# Altium project ProyectoMulticapa.PrjPcb (part 3 of 3)

## Sheet [5] In Circuit Debug Interface.SchDoc
size Letter; Author: Ángel O., Victor V.; DocumentNumber: 5; Revision: 1.0; SheetNumber: 5; SheetTotal: 6
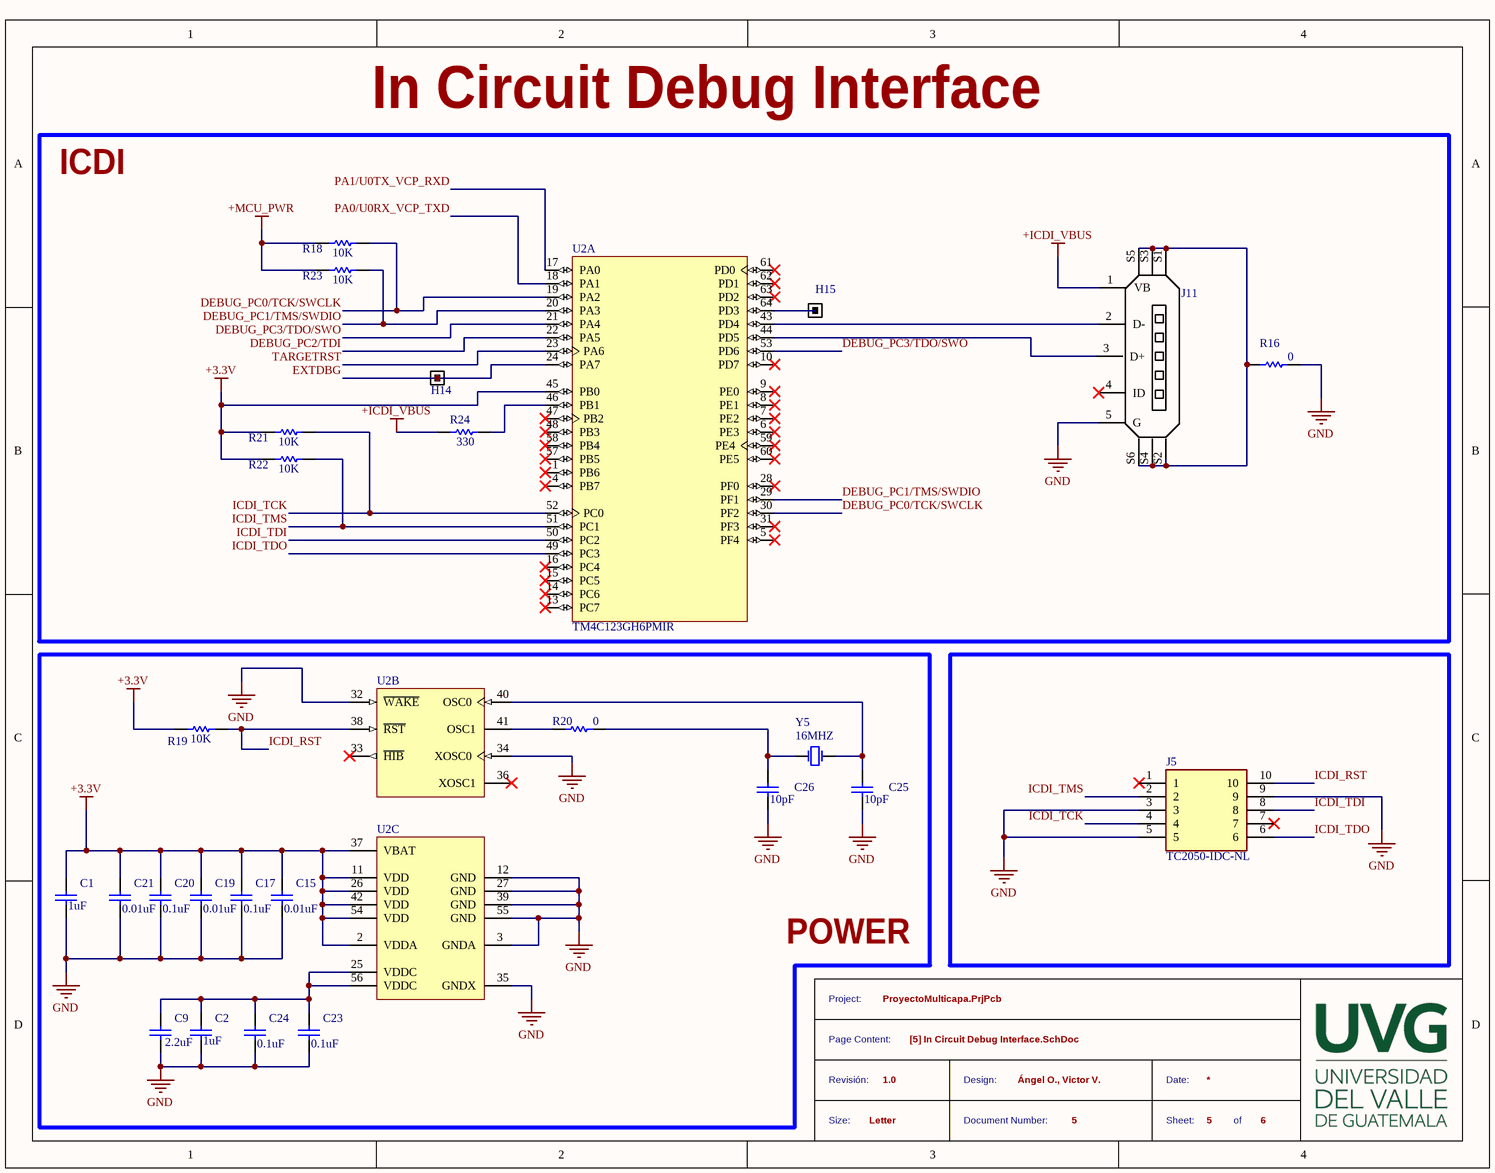
[diagram p5: [5] In Circuit Debug Interface.SchDoc]

### Parts
C1  capacitor Johanson Dielectrics Inc  [C0402 imperial]  (value not drawn)
C2  capacitor Johanson Dielectrics Inc  [C0402 imperial]  (value not drawn)
C9  GRM188R61C225KE15D  [CAPC1608X90X35LL10T15]  (value not drawn)
C15  EMK105B7103KV-F  [CAPC1005]  (value not drawn)
C17  EMK105B7104KV-F  [CAPC1005]  (value not drawn)
C19  EMK105B7103KV-F  [CAPC1005]  (value not drawn)
C20  EMK105B7104KV-F  [CAPC1005]  (value not drawn)
C21  EMK105B7103KV-F  [CAPC1005]  (value not drawn)
C23  EMK105B7104KV-F  [CAPC1005]  (value not drawn)
C24  EMK105B7104KV-F  [CAPC1005]  (value not drawn)
C25  GRM1555C1H100JZ01D  [CAPC1005X55X25LL05T10]  (value not drawn)
C26  GRM1555C1H100JZ01D  [CAPC1005X55X25LL05T10]  (value not drawn)
H14  header  [HEADER 1]  (value not drawn)
H15  header  [HEADER 1]  (value not drawn)
J5  TC2050-IDC-NL  [TAG-CONNECT_TC2050-IDC-NL]
J11  ZX62-B-5PA  [ZX62B5PA]  (value not drawn)
R16  ERJ-3GEY0R00V  [FP-ERJ-3GEY0R00V-IPC_A]  (value not drawn)
R18  RC0402FR-0710KL  [RESC1005X40X25LL05T10]  (value not drawn)
R19  RC0402FR-0710KL  [RESC1005X40X25LL05T10]  (value not drawn)
R20  ERJ-3GEY0R00V  [FP-ERJ-3GEY0R00V-IPC_A]  (value not drawn)
R21  RC0402FR-0710KL  [RESC1005X40X25LL05T10]  (value not drawn)
R22  RC0402FR-0710KL  [RESC1005X40X25LL05T10]  (value not drawn)
R23  RC0402FR-0710KL  [RESC1005X40X25LL05T10]  (value not drawn)
R24  RC0402FR-07330RL  [RESC1005X40X25LL05T10]  (value not drawn)
U2  TM4C123GH6PMIR  [PM0064A_L]  (parts A,B,C of 3)
Y5  NX5032GA-16.000000MHZ  [NX5032GA16000000MHZLNCD1]  (value not drawn)

### Blocks framed on the sheet
ICDI: H14 H15 J11 R16 R18 R21-R24 U2
POWER: C1 C2 C9 C15 C17 C19-C21 C23-C26 R19 R20 U2 Y5

### Nets
+3.3V: C1.1 C15.1 C17.1 C19.1 C20.1 C21.1 R19.1 R21.1 R22.1 U2.2(VDDA) U2.11(VDD) U2.26(VDD) U2.37(VBAT) U2.42(VDD) U2.45(PB0) U2.54(VDD)
+ICDI_VBUS: J11.1(VB) R24.1
+MCU_PWR: R18.1 R23.1
GND: C1.2 C2.2 C9.2 C15.2 C17.2 C19.2 C20.2 C21.2 C23.2 C24.2 C25.2 C26.2 J5.3 J5.5 J5.9 J11.5(G) R16.2 U2.3(GNDA) U2.12(GND) U2.27(GND) U2.32(~{WAKE}) U2.34(XOSC0) U2.35(GNDX) U2.39(GND) U2.55(GND)
DEBUG_PC0/TCK/SWCLK: R18.2 U2.19(PA2) U2.30(PF2)
DEBUG_PC1/TMS/SWDIO: R23.2 U2.20(PA3) U2.29(PF1)
DEBUG_PC2/TDI: U2.22(PA5)
DEBUG_PC3/TDO/SWO: U2.21(PA4) U2.53(PD6)
EXTDBG: H14.1 U2.24(PA7)
ICDI_RST: J5.10 R19.2 U2.38(~{RST})
ICDI_TCK: J5.4 R21.2 U2.52(PC0)
ICDI_TDI: J5.8 U2.50(PC2)
ICDI_TDO: J5.6 U2.49(PC3)
ICDI_TMS: J5.2 R22.2 U2.51(PC1)
PA0/U0RX_VCP_TXD: U2.18(PA1)
PA1/U0TX_VCP_RXD: U2.17(PA0)
TARGETRST: U2.23(PA6)
NetC2_1: C2.1 C9.1 C23.1 C24.1 U2.25(VDDC) U2.56(VDDC)
NetC25_1: C25.1 U2.40(OSC0) Y5.2
NetC26_1: C26.1 R20.2 Y5.1
NetH15_1: H15.1 U2.64(PD3)
NetJ11_2: J11.2(D-) U2.43(PD4)
NetJ11_3: J11.3(D+) U2.44(PD5)
NetJ11_S1: J11.S1 J11.S2 J11.S3 J11.S4 J11.S5 J11.S6 R16.1
NetR20_1: R20.1 U2.41(OSC1)
NetR24_2: R24.2 U2.46(PB1)

Not connected (* = marked no-connect by the designer): J5 1* 7*; J11 4(ID)*; U2 1(PB6)* 4(PB7)* 5(PF4)* 6(PE3)* 7(PE2)* 8(PE1)* 9(PE0)* 10(PD7)* 13(PC7)* 14(PC6)* 15(PC5)* 16(PC4)* 28(PF0)* 31(PF3)* 33(~{HIB})* 36(XOSC1)* 47(PB2)* 48(PB3)* 57(PB5)* 58(PB4)* 59(PE4)* 60(PE5)* 61(PD0)* 62(PD1)* 63(PD2)*

### Notes on the sheet
- In Circuit Debug Interface
- Project:
- Page Content:
- Revisión:
- Size:
- Letter
- Design:
- Document Number:
- Date:
- Sheet:
- of
- (in symbol EMK105B7103KV-F) 0.01uF
- (in symbol EMK105B7104KV-F) 0.1uF
- (in symbol ERJ-3GEY0R00V) 0
- (in symbol NX5032GA-16.000000MHZ) 16MHZ
- (in symbol RC0402FR-0710KL) 10K
- (in symbol RC0402FR-07330RL) 330

### Library data of the parts
C1 C2 = 100R07X105KV4T: Cap Ceramic 1uF 10V X5R 10% SMD 0402 85C T/R; Supplier 1: Mouser; Manufacturer: Johanson; Manufacturer Part Number: 100R07X105KV4T; Stock 1: 173156; Pricing 1: 1 = 0.26000, 10 = 0.13400, 50 = 0.13400, 100 = 0.07600, 1000 = 0.04900, 10000 = 0.04000 (USD); RoHS: Yes; Mount: Surface Mount; Case/Package: 0402; Number of Pins: 2; Case Code (Metric): 1005; Case Code (Imperial): 0402; Weight: 2.3E-05oz; Min Operating Temperature: -55°C; Max Operating Temperature: 85°C; Capacitance: 1uF; Tolerance: 10%; Voltage Rating: 10V; Packaging: Tape and Reel; Package Quantity: 10000; Voltage Rating (DC): 10V; Dielectric: X5R; Termination: SMD/SMT; Series: TANCERAM®; Length: 1.02mm; Width: 0.02inch; Height: 0.64mm; Thickness: 0.025inch; Depth: 0.51mm; Radiation Hardening: No; REACH SVHC: No SVHC; RoHS Compliant: Yes; ComponentLink1URL: https://datasheet.ciiva.com/26948/getdatasheetpartid-789067-26948543.pdf?src-supplier=Verical; ComponentLink1Description: https://datasheet.ciiva.com/26948/getdatasheetpartid-789067-26948543.pdf?src-supplier=Verical; ComponentLink2URL: https://datasheet.ciiva.com/22693/jdi-full-catalog-2012-01-22693744.pdf?src-supplier=Element14; ComponentLink2Description: https://datasheet.ciiva.com/22693/jdi-full-catalog-2012-01-22693744.pdf?src-supplier=Element14; Supplier Part Number 1: 605-100R07X105KV4T
C9 = GRM188R61C225KE15D: Cap Ceramic 2.2uF 16V X5R 10% SMD 0603 85C Paper T/R; Manufacturer: Murata; Supplier 1: Farnell; Manufacturer Part Number: GRM188R61C225KE15D; Stock 1: 0; Pricing 1: 10 = 0.13600, 100 = 0.08010, 500 = 0.05040, 1000 = 0.04260, 2000 = 0.03240 (GBP); RoHS: Yes; Mount: Surface Mount; Case/Package: 0603; Case Code (Imperial): 0603; Case Code (Metric): 1608; Material: Ceramic; Min Operating Temperature: -55°C; Max Operating Temperature: 85°C; Capacitance: 2.2uF; Tolerance: 10%; Dielectric: X5R; Voltage Rating: 16V; Voltage Rating (DC): 16V; Packaging: Tape and Reel; Package Quantity: 1; Termination: SMD/SMT; Voltage: 16V; Length: 1.6mm; Width: 0.8mm; Height: 0.8mm; Thickness: 0.035inch; Depth: 0.8mm; Radiation Hardening: No; RoHS Compliant: Yes; Lead Free: Lead Free; REACH SVHC: No SVHC; ComponentLink1URL: https://datasheet.ciiva.com/135/grm188r61c225ke15-01-135062.pdf?src-supplier=Digi-Key; ComponentLink1Description: https://datasheet.ciiva.com/135/grm188r61c225ke15-01-135062.pdf?src-supplier=Digi-Key; ComponentLink2URL: https://datasheet.ciiva.com/135/grm188r61c225ke15-01-135063.pdf?src-supplier=Digi-Key; ComponentLink2Description: https://datasheet.ciiva.com/135/grm188r61c225ke15-01-135063.pdf?src-supplier=Digi-Key; ComponentLink3URL: https://datasheet.ciiva.com/5417/product-5417088.pdf?src-supplier=Mouser; ComponentLink3Description: https://datasheet.ciiva.com/5417/product-5417088.pdf?src-supplier=Mouser; ComponentLink4URL: https://datasheet.ciiva.com/3777/147grm188r61c225ke1523-3777042.pdf?src-supplier=Arrow+Electronics; ComponentLink4Description: https://datasheet.ciiva.com/3777/147grm188r61c225ke1523-3777042.pdf?src-supplier=Arrow+Electronics; ComponentLink5URL: https://datasheet.ciiva.com/29199/454457-da-01-en-vs-kondensator-0603-29199689.pdf?src-supplier=Conrad; ComponentLink5Description: https://datasheet.ciiva.com/29199/454457-da-01-en-vs-kondensator-0603-29199689.pdf?src-supplier=Conrad; ComponentLink6URL: https://datasheet.ciiva.com/135/grm188r61c225ke15-01-135061.pdf?src-supplier=Digi-Key; ComponentLink6Description: https://datasheet.ciiva.com/135/grm188r61c225ke15-01-135061.pdf?src-supplier=Digi-Key; ComponentLink7URL: https://datasheet.ciiva.com/16369/product-16369274.pdf?src-supplier=Future+Electronics; ComponentLink7Description: https://datasheet.ciiva.com/16369/product-16369274.pdf?src-supplier=Future+Electronics; Supplier Part Number 1: 1735526
C15 C19 C21 = EMK105B7103KV-F: TAIYO YUDEN   EMK105B7103KV-F   CERAMIC CAPACITOR, 0.01UF, 16V, X7R, 10%, 0402, FULL REEL; Capacitance: 10nF; Supplier 1: Digi-Key; Manufacturer: Taiyo Yuden; Manufacturer Part Number: EMK105B7103KV-F; Stock 1: 171674; Pricing 1: 1 = 0.10000, 10 = 0.02500, 50 = 0.01380, 100 = 0.01130, 500 = 0.00804, 1000 = 0.00632, 2500 = 0.00575, 5000 = 0.00529 (USD); RoHS: Yes; Mount: Surface Mount; Case/Package: 0402; Number of Pins: 2; Case Code (Metric): 1005; Case Code (Imperial): 0402; Contact Plating: Tin; Min Operating Temperature: -55°C; Max Operating Temperature: 125°C; Package Quantity: 1; Voltage Rating: 16V; Tolerance: 10%; Packaging: Tape and Reel; Voltage Rating (DC): 16V; Dielectric: X7R; Termination: SMD/SMT; Series: M; Construction: Flat; Resistor Type: Ceramic; Length: 1mm; Width: 0.02inch; Height: 0.5mm; Thickness: 0.022inch; Depth: 0.5mm; Radiation Hardening: No; REACH SVHC: Unknown; RoHS Compliant: Yes; ComponentLink1URL: https://datasheet.ciiva.com/156/mlcc-all-e-156078.pdf?src-supplier=Digi-Key; ComponentLink1Description: https://datasheet.ciiva.com/156/mlcc-all-e-156078.pdf?src-supplier=Digi-Key; ComponentLink2URL: https://datasheet.ciiva.com/156/mlcc-all-e-156079.pdf?src-supplier=Digi-Key; ComponentLink2Description: https://datasheet.ciiva.com/156/mlcc-all-e-156079.pdf?src-supplier=Digi-Key; ComponentLink3URL: https://datasheet.ciiva.com/156/mlcc-all-e-156080.pdf?src-supplier=Digi-Key; ComponentLink3Description: https://datasheet.ciiva.com/156/mlcc-all-e-156080.pdf?src-supplier=Digi-Key; ComponentLink4URL: https://datasheet.ciiva.com/11596/mlcc01-e-11596553.pdf?src-supplier=Avnet; ComponentLink4Description: https://datasheet.ciiva.com/11596/mlcc01-e-11596553.pdf?src-supplier=Avnet; ComponentLink5URL: https://datasheet.ciiva.com/28644/746258-28644943.pdf?src-supplier=Element14; ComponentLink5Description: https://datasheet.ciiva.com/28644/746258-28644943.pdf?src-supplier=Element14; ComponentLink6URL: https://datasheet.ciiva.com/7975/1481447-7975594.pdf?src-supplier=Element14; ComponentLink6Description: https://datasheet.ciiva.com/7975/1481447-7975594.pdf?src-supplier=Element14; Supplier Part Number 1: 587-2708-1-ND
C17 C20 C23 C24 = EMK105B7104KV-F: TAIYO YUDEN - EMK105B7104KV-F - SMD Multilayer Ceramic Capacitor, 0.1 &#181;F, 16 V, 0402 [1005 Metric], &#177; 10%, X7R, M Series; Capacitance: 100nF; Voltage Rating (DC): 16V; Supplier 1: Digi-Key; Manufacturer: Taiyo Yuden; Manufacturer Part Number: EMK105B7104KV-F; Stock 1: 5046270; Pricing 1: 1 = 0.10000, 10 = 0.02400, 50 = 0.01320, 100 = 0.01070, 500 = 0.00764, 1000 = 0.00601, 2500 = 0.00546, 5000 = 0.00503 (USD); RoHS: Yes; Mount: Surface Mount; Case/Package: 0402; Number of Pins: 2; Case Code (Metric): 1005; Case Code (Imperial): 0402; Min Operating Temperature: -55°C; Max Operating Temperature: 125°C; Tolerance: 10%; Packaging: Tape and Reel; Dielectric: X7R; Package Quantity: 1; Voltage Rating: 16V; Termination: SMD/SMT; Series: M; Construction: Flat; Resistor Type: Ceramic; Length: 1mm; Width: 0.02inch; Height: 0.5mm; Thickness: 0.022inch; Depth: 0.5mm; Radiation Hardening: No; Halogen Free: Halogen Free; REACH SVHC: Unknown; RoHS Compliant: Yes; Lead Free: Lead Free; ComponentLink1URL: https://datasheet.ciiva.com/129/emk105b7104kv-f-ss-129714.pdf?src-supplier=Digi-Key; ComponentLink1Description: https://datasheet.ciiva.com/129/emk105b7104kv-f-ss-129714.pdf?src-supplier=Digi-Key; ComponentLink2URL: https://datasheet.ciiva.com/30227/emk105b7104kv-f-30227394.pdf?src-supplier=Onlinecomponents.com; ComponentLink2Description: https://datasheet.ciiva.com/30227/emk105b7104kv-f-30227394.pdf?src-supplier=Onlinecomponents.com; ComponentLink3URL: https://datasheet.ciiva.com/22748/746258-22748959.pdf?src-supplier=Element14; ComponentLink3Description: https://datasheet.ciiva.com/22748/746258-22748959.pdf?src-supplier=Element14; Supplier Part Number 1: 587-1451-1-ND
C25 C26 = GRM1555C1H100JZ01D: CAP, CERAMIC, 10PF, 50V, C0G/NP0, 0402; Manufacturer: Murata; Tolerance: 5%; Dielectric: C0G; Insulation Resistance: 10GR; Temperature Coefficient: 30ppm/°C; Supplier 1: Farnell; Manufacturer Part Number: GRM1555C1H100JZ01D; Stock 1: 0; Pricing 1: 1 = 37.68000, 3 = 28.53000 (GBP); RoHS: Yes; Mount: Surface Mount; Case/Package: 0402; Number of Pins: 2; Case Code (Imperial): 0402; Case Code (Metric): 1005; Dielectric Material: Ceramic; Min Operating Temperature: -55°C; Max Operating Temperature: 125°C; Capacitance: 10pF; Voltage Rating: 50V; Voltage Rating (DC): 50V; Packaging: Tape and Reel; Package Quantity: 1; Termination: SMD/SMT; Voltage: 50V; Series: GRM; Construction: Flat; Length: 1mm; Width: 0.5mm; Height: 0.5mm; Thickness: 0.022inch; Depth: 0.5mm; Size: 0.5mm; Radiation Hardening: No; REACH SVHC: No SVHC; Lead Free: Lead Free; RoHS Compliant: Yes; ComponentLink1URL: https://datasheet.ciiva.com/129/partnumbering-e-01-129819.pdf?src-supplier=Digi-Key; ComponentLink1Description: https://datasheet.ciiva.com/129/partnumbering-e-01-129819.pdf?src-supplier=Digi-Key; ComponentLink2URL: https://datasheet.ciiva.com/129/partnumbering-e-01-129820.pdf?src-supplier=Digi-Key; ComponentLink2Description: https://datasheet.ciiva.com/129/partnumbering-e-01-129820.pdf?src-supplier=Digi-Key; ComponentLink3URL: https://datasheet.ciiva.com/129/partnumbering-e-01-129821.pdf?src-supplier=Digi-Key; ComponentLink3Description: https://datasheet.ciiva.com/129/partnumbering-e-01-129821.pdf?src-supplier=Digi-Key; ComponentLink4URL: https://datasheet.ciiva.com/19476/1855887-19476237.pdf?src-supplier=Jameco; ComponentLink4Description: https://datasheet.ciiva.com/19476/1855887-19476237.pdf?src-supplier=Jameco; ComponentLink5URL: https://datasheet.ciiva.com/18184/getdatasheetpartid-91958-18184166.pdf?src-supplier=Verical; ComponentLink5Description: https://datasheet.ciiva.com/18184/getdatasheetpartid-91958-18184166.pdf?src-supplier=Verical; ComponentLink6URL: https://datasheet.ciiva.com/11787/0900766b807a1cab-11787097.pdf?src-supplier=RSComponents; ComponentLink6Description: https://datasheet.ciiva.com/11787/0900766b807a1cab-11787097.pdf?src-supplier=RSComponents; ComponentLink7URL: https://datasheet.ciiva.com/6068/1747431-6068159.pdf?src-supplier=Farnell; ComponentLink7Description: https://datasheet.ciiva.com/6068/1747431-6068159.pdf?src-supplier=Farnell; ComponentLink8URL: https://datasheet.ciiva.com/11607/c02e-11607480.pdf?src-supplier=Avnet; ComponentLink8Description: https://datasheet.ciiva.com/11607/c02e-11607480.pdf?src-supplier=Avnet; ComponentLink9URL: https://datasheet.ciiva.com/14116/grmseries-tc-hitype-eng-14116856.pdf?src-supplier=Distrelec; ComponentLink9Description: https://datasheet.ciiva.com/14116/grmseries-tc-hitype-eng-14116856.pdf?src-supplier=Distrelec; ComponentLink10URL: https://datasheet.ciiva.com/14116/grmseries-tc-hitype-eng-14116917.pdf?src-supplier=Distrelec; ComponentLink10Description: https://datasheet.ciiva.com/14116/grmseries-tc-hitype-eng-14116917.pdf?src-supplier=Distrelec; ComponentLink11URL: https://datasheet.ciiva.com/7828/1747431-7828813.pdf?src-supplier=Element14; ComponentLink11Description: https://datasheet.ciiva.com/7828/1747431-7828813.pdf?src-supplier=Element14; ComponentLink12URL: https://datasheet.ciiva.com/7828/1747431-7828815.pdf?src-supplier=Element14; ComponentLink12Description: https://datasheet.ciiva.com/7828/1747431-7828815.pdf?src-supplier=Element14; Supplier Part Number 1: 1118131
H14 H15 = header: Pads header que aparecen en la tiva
J5 = TC2050-IDC-NL: Plug-Of-Nailsâ„¢ Adapter Cable; MF: Tag-Connect LLC; MP: TC2050-IDC-NL; Availability: Unavailable; Package: None; Value: *; Price: None; SnapEDA_Link: https://www.snapeda.com/parts/TC2050-IDC-NL/Tag-Connect%20LLC/view-part/134534/?ref=snap
J11 = ZX62-B-5PA: USB Connectors MICRO B RECEPT RA SMT BTTM MNT; Manufacturer: Hirose; Manufacturer Part Number: ZX62-B-5PA(11); Number of Terminals/Pins: 5; Connector Type: USB,Receptacle; Gender: Receptacle; Current Rating: 1A; Mating Cycles: 10000; Voltage Rating: 30V; Number of Ports: 1; USB Standard: USB 2.0; Pitch: 0.65mm; Supplier 1: Farnell; Stock 1: 0; Pricing 1: 10 = 0.60800, 50 = 0.48000, 100 = 0.44900, 250 = 0.43000, 500 = 0.39100, 1000 = 0.35900 (GBP); RoHS: Yes; Mount: Surface Mount,Horizontal; Contact Plating: Gold; Contact Material: Copper Alloy; Min Operating Temperature: -30°C; Max Operating Temperature: 85°C; Packaging: Tape and Reel; Number of Contacts: 5; Package Quantity: 3500; Series: ZX62; Termination: Solder; Orientation: Right Angle; Number of Positions: 5; Max Voltage Rating (AC): 30V; Voltage Rating (AC): 30V; Length: 7.9mm; Depth: 5.6mm; Radiation Hardening: No; RoHS Compliant: Yes; REACH SVHC: No SVHC; Lead Free: Lead Free; Flammability Rating: UL94 V-0; ComponentLink1URL: https://datasheet.ciiva.com/11731/0900766b80d9c4df-11731324.pdf?src-supplier=RSComponents; ComponentLink1Description: https://datasheet.ciiva.com/11731/0900766b80d9c4df-11731324.pdf?src-supplier=RSComponents; ComponentLink2URL: https://datasheet.ciiva.com/15181/getdatasheetpartid-449685-15181366.pdf?src-supplier=Verical; ComponentLink2Description: https://datasheet.ciiva.com/15181/getdatasheetpartid-449685-15181366.pdf?src-supplier=Verical; ComponentLink3URL: https://datasheet.ciiva.com/7646/81390-7646778.pdf?src-supplier=Element14; ComponentLink3Description: https://datasheet.ciiva.com/7646/81390-7646778.pdf?src-supplier=Element14; Supplier 2: Mouser; Stock 2: 45031; Pricing 2: 1 = 0.61000, 10 = 0.57200, 50 = 0.57200, 100 = 0.46800, 1000 = 0.37700, 10000 = 0.33800 (USD); ComponentLink4URL: http://www.farnell.com/datasheets/2691174.pdf?src-supplier=Farnell; ComponentLink4Description: http://www.farnell.com/datasheets/2691174.pdf?src-supplier=Farnell; ComponentLink5URL: https://www.hirose.com/product/en/download_file/key_name/ZX62-B-5PA%2833%29/category/Specification%20Sheet/doc_file_id/87473/?file_category_id=9&item_id=02420033833&is_series=&src-supplier=Digi-Key; ComponentLink5Description: https://www.hirose.com/product/en/download_file/key_name/ZX62-B-5PA%2833%29/category/Specification%20Sheet/doc_file_id/87473/?file_category_id=9&item_id=02420033833&is_series=&src-supplier=Digi-Key; ComponentLink6URL: http://www.farnell.com/datasheets/2691174.pdf?src-supplier=Newark; ComponentLink6Description: http://www.farnell.com/datasheets/2691174.pdf?src-supplier=Newark; ComponentLink7URL: http://www.farnell.com/datasheets/2691174.pdf?src-supplier=Element14; ComponentLink7Description: http://www.farnell.com/datasheets/2691174.pdf?src-supplier=Element14; ComponentLink8URL: http://www.farnell.com/datasheets/2060515.pdf?src-supplier=Element14; ComponentLink8Description: http://www.farnell.com/datasheets/2060515.pdf?src-supplier=Element14; Supplier Part Number 1: 1645325; Supplier Part Number 2: 798-ZX62-B-5PA33
R16 R20 = ERJ-3GEY0R00V: Res Thick Film 0603 0 Ohm Jumper Molded SMD Punched Carrier T/R; Manufacturer: Panasonic; Resistance: 0R; Power Rating: 100mW; Voltage Rating: 75V; Tolerance: 0%; Temperature Coefficient: 600ppm/°C; Voltage Rating (DC): 50V; Supplier 1: Future Electronics; Manufacturer Part Number: ERJ-3GEY0R00V; Stock 1: 910317; Pricing 1: 1 = 0.01920, 50 = 0.01640, 100 = 0.01600, 500 = 0.01500, 1500 = 0.01440 (USD); RoHS: Yes; Mount: Surface Mount; Case/Package: 0603; Contact Plating: Tin; Case Code (Metric): 1608; Case Code (Imperial): 0603; Size Code: 0603; Min Operating Temperature: -55°C; Max Operating Temperature: 155°C; Resistor Type: Thick Film; Packaging: Tape and Reel; Package Quantity: 1; Number of Terminations: 2; Termination: SMD/SMT; Max Power Dissipation: 100mW; Features: Automotive AEC-Q200; Series: ERJ; Construction: Rectangular; Technology: THICK FILM; Length: 1.6mm; Width: 0.031inch; Height: 0.45mm; Depth: 0.8mm; Radiation Hardening: No; REACH SVHC: No SVHC; Military Standard: Not; Lead Free: Lead Free; RoHS Compliant: Yes; ComponentLink1URL: https://datasheet.ciiva.com/11808/0900766b80f806dd-11808207.pdf?src-supplier=RSComponents; ComponentLink1Description: https://datasheet.ciiva.com/11808/0900766b80f806dd-11808207.pdf?src-supplier=RSComponents; ComponentLink2URL: https://datasheet.ciiva.com/27055/1935748-27055113.pdf?src-supplier=Jameco; ComponentLink2Description: https://datasheet.ciiva.com/27055/1935748-27055113.pdf?src-supplier=Jameco; ComponentLink3URL: https://datasheet.ciiva.com/48532/aoa0000ce1-48532165.pdf?src-supplier=Avnet; ComponentLink3Description: https://datasheet.ciiva.com/48532/aoa0000ce1-48532165.pdf?src-supplier=Avnet; ComponentLink4URL: https://datasheet.ciiva.com/5959/1678796-5959707.pdf?src-supplier=Farnell; ComponentLink4Description: https://datasheet.ciiva.com/5959/1678796-5959707.pdf?src-supplier=Farnell; ComponentLink5URL: https://datasheet.ciiva.com/43460/1678796-43460647.pdf?src-supplier=Farnell; ComponentLink5Description: https://datasheet.ciiva.com/43460/1678796-43460647.pdf?src-supplier=Farnell; ComponentLink6URL: https://datasheet.ciiva.com/9198/aoa0000ce1-9198975.pdf?src-supplier=Avnet; ComponentLink6Description: https://datasheet.ciiva.com/9198/aoa0000ce1-9198975.pdf?src-supplier=Avnet; ComponentLink7URL: https://datasheet.ciiva.com/30199/4aoa0000ce1-30199822.pdf?src-supplier=Onlinecomponents.com; ComponentLink7Description: https://datasheet.ciiva.com/30199/4aoa0000ce1-30199822.pdf?src-supplier=Onlinecomponents.com; ComponentLink8URL: https://datasheet.ciiva.com/16758/70255313-16758527.pdf?src-supplier=Allied+Electronics; ComponentLink8Description: https://datasheet.ciiva.com/16758/70255313-16758527.pdf?src-supplier=Allied+Electronics; ComponentLink9URL: https://datasheet.ciiva.com/16834/aoa0000ce1-16834828.pdf?src-supplier=Future+Electronics; ComponentLink9Description: https://datasheet.ciiva.com/16834/aoa0000ce1-16834828.pdf?src-supplier=Future+Electronics; ComponentLink10URL: https://datasheet.ciiva.com/46377/1678796-46377868.pdf?src-supplier=Element14; ComponentLink10Description: https://datasheet.ciiva.com/46377/1678796-46377868.pdf?src-supplier=Element14; ComponentLink11URL: https://datasheet.ciiva.com/28695/1678796-28695833.pdf?src-supplier=Element14; ComponentLink11Description: https://datasheet.ciiva.com/28695/1678796-28695833.pdf?src-supplier=Element14; ComponentLink12URL: https://datasheet.ciiva.com/17215/aoa0000ce1-17215388.pdf?src-supplier=Avnet+Europe; ComponentLink12Description: https://datasheet.ciiva.com/17215/aoa0000ce1-17215388.pdf?src-supplier=Avnet+Europe; Supplier Part Number 1: 4103908
R18 R19 R21-R23 = RC0402FR-0710KL: Surface Mount Thick Film Resistor, Rc Series, 10 Kohm, 62.5 Mw, - 1%, 50 V, 0402 [1005 Metric]; Manufacturer: Yageo; Resistance: 10kR; Temperature Coefficient: 100ppm/°C; Voltage Rating (DC): 50V; Power Rating: 62.5mW; Max Power Dissipation: 63mW; Supplier 1: Digi-Key; Manufacturer Part Number: RC0402FR-0710KL; Stock 1: 6227591; Pricing 1: 1 = 0.10000, 10 = 0.01600, 100 = 0.00660, 1000 = 0.00299, 2500 = 0.00259, 5000 = 0.00214 (USD); RoHS: Yes; Case/Package: 0402; Number of Pins: 2; Case Code (Imperial): 0402; Case Code (Metric): 1005; Min Operating Temperature: -55°C; Max Operating Temperature: 155°C; Resistor Type: Thick Film; Tolerance: 1%; Packaging: Tape and Reel; Voltage Rating: 50V; Termination: SMD/SMT; Working Voltage: 50V; Number of Terminations: 2; Features: Moisture Resistant; Series: RC; Resistance Tolerance: 1%; Construction: Rectangular; Length: 1mm; Width: 0.5mm; Height: 0.32mm; Depth: 0.5mm; Lead Pitch: 0.2mm; REACH SVHC: No SVHC; Lead Free: Lead Free; RoHS Compliant: Yes; Military Standard: Not; ComponentLink1URL: https://datasheet.ciiva.com/7660/38568-7660787.pdf?src-supplier=Element14; ComponentLink1Description: https://datasheet.ciiva.com/7660/38568-7660787.pdf?src-supplier=Element14; ComponentLink2URL: https://datasheet.ciiva.com/12667/pyu-rc0402-51-rohs-l-6-r-12667067.pdf?src-supplier=Mouser; ComponentLink2Description: https://datasheet.ciiva.com/12667/pyu-rc0402-51-rohs-l-6-r-12667067.pdf?src-supplier=Mouser; ComponentLink3URL: https://datasheet.ciiva.com/7849/1784430-7849813.pdf?src-supplier=Element14; ComponentLink3Description: https://datasheet.ciiva.com/7849/1784430-7849813.pdf?src-supplier=Element14; ComponentLink4URL: https://datasheet.ciiva.com/7849/1686128-7849814.pdf?src-supplier=Element14; ComponentLink4Description: https://datasheet.ciiva.com/7849/1686128-7849814.pdf?src-supplier=Element14; ComponentLink5URL: https://datasheet.ciiva.com/7849/1784430-7849815.pdf?src-supplier=Element14; ComponentLink5Description: https://datasheet.ciiva.com/7849/1784430-7849815.pdf?src-supplier=Element14; ComponentLink6URL: https://datasheet.ciiva.com/7983/1018594-7983486.pdf?src-supplier=Element14; ComponentLink6Description: https://datasheet.ciiva.com/7983/1018594-7983486.pdf?src-supplier=Element14; ComponentLink7URL: https://datasheet.ciiva.com/22747/1018594-22747512.pdf?src-supplier=Element14; ComponentLink7Description: https://datasheet.ciiva.com/22747/1018594-22747512.pdf?src-supplier=Element14; Supplier Part Number 1: 311-10.0KLRCT-ND
R24 = RC0402FR-07330RL: Res Thick Film 0402 330 Ohm 1% 0.063W(1/16W) ±100ppm/C Pad SMD T/R; Manufacturer: Yageo / Phycomp; Resistance: 330R; Temperature Coefficient: 100ppm/°C; Power Rating: 62.5mW; Voltage Rating: 50V; Max Power Dissipation: 63mW; Part Number: RC0402FR-07330RL; Supplier 1: Future Electronics; Manufacturer Part Number: RC0402FR-07330RL; Stock 1: 814184; Pricing 1: 1 = 0.00590, 500 = 0.00300, 1500 = 0.00260, 2500 = 0.00250, 5000 = 0.00230 (USD); RoHS: Yes; Case/Package: 0402; Case Code (Metric): 1005; Case Code (Imperial): 0402; Size Code: 0402; Min Operating Temperature: -55°C; Max Operating Temperature: 155°C; Packaging: Tape and Reel; Tolerance: 1%; Package Quantity: 1; Resistor Type: Thick Film; Number of Terminations: 2; Termination: SMD/SMT; Features: Moisture Resistant; Series: RC; Construction: Rectangular; Technology: THICK FILM; Resistance Tolerance: 1%; Length: 0.039inch; Width: 0.02inch; Height: 0.016inch; Depth: 0.5mm; RoHS Compliant: Yes; REACH SVHC: Unknown; Military Standard: Not; Lead Free: Lead Free; ComponentLink1URL: https://datasheet.ciiva.com/11819/0900766b80c66297-11819490.pdf?src-supplier=RSComponents; ComponentLink1Description: https://datasheet.ciiva.com/11819/0900766b80c66297-11819490.pdf?src-supplier=RSComponents; ComponentLink2URL: https://datasheet.ciiva.com/12656/pyu-rc0402-51-rohs-l-6-r-12656815.pdf?src-supplier=Mouser; ComponentLink2Description: https://datasheet.ciiva.com/12656/pyu-rc0402-51-rohs-l-6-r-12656815.pdf?src-supplier=Mouser; ComponentLink3URL: https://datasheet.ciiva.com/2453/pyu-r-int-thick-7-2453661.pdf?src-supplier=Digi-Key; ComponentLink3Description: https://datasheet.ciiva.com/2453/pyu-r-int-thick-7-2453661.pdf?src-supplier=Digi-Key; ComponentLink4URL: https://datasheet.ciiva.com/2453/pyu-r-int-thick-7-2453662.pdf?src-supplier=Digi-Key; ComponentLink4Description: https://datasheet.ciiva.com/2453/pyu-r-int-thick-7-2453662.pdf?src-supplier=Digi-Key; ComponentLink5URL: https://datasheet.ciiva.com/2453/pyu-r-int-thick-7-2453663.pdf?src-supplier=Digi-Key; ComponentLink5Description: https://datasheet.ciiva.com/2453/pyu-r-int-thick-7-2453663.pdf?src-supplier=Digi-Key; ComponentLink6URL: https://datasheet.ciiva.com/7849/1018594-7849962.pdf?src-supplier=Element14; ComponentLink6Description: https://datasheet.ciiva.com/7849/1018594-7849962.pdf?src-supplier=Element14; ComponentLink7URL: https://datasheet.ciiva.com/7849/1018594-7849963.pdf?src-supplier=Element14; ComponentLink7Description: https://datasheet.ciiva.com/7849/1018594-7849963.pdf?src-supplier=Element14; ComponentLink8URL: https://datasheet.ciiva.com/17083/pyu-rc0402-51-rohs-l-6-r-17083994.pdf?src-supplier=Future+Electronics; ComponentLink8Description: https://datasheet.ciiva.com/17083/pyu-rc0402-51-rohs-l-6-r-17083994.pdf?src-supplier=Future+Electronics; Supplier Part Number 1: 6023220
U2 = TM4C123GH6PMI: Tiva C Series Microcontroller, 256 KB Flash, 32 KB SRAM, 12 Bit, 12 Channels, -40 to 85 degC, 64-Pin LQFP (PM), Green (RoHS & no Sb/Br), Tape and Reel; Manufacturer: Texas Instruments; Data Memory: 32 KB; UART: 4; Max Speed: 80 MHz; I2C: 2; GPIOs: 43; ADC Channels: 12; Program Memory: 256 KB; ADC Resolution: 12 Bit; Tiva Series: Connected MCUs; Prefix: Qualified Device; Interface: I2C,USB,CAN,UART,SPI,IrDA,USART,I2S; Data Bus Width: 32b; Core Architecture: ARM; RAM Size: 32KB; Frequency: 80MHz; Oscillator Type: Internal; Number of Programmable I/O: 49; Watchdog Timer: Yes; Memory Size: 256KB; Peripherals: Brown-out Detect/Reset,POR,PWM,WDT,DMA; Max Supply Voltage: 3.63V; Min Supply Voltage: 3.15V; Operating Supply Voltage: 3.3V; ComponentLink2URL: http://www.ti.com/lit/ds/symlink/tm4c123gh6pm.pdf; Temperature Range: -40 to 85 degC; ComponentLink2Description: Datasheet; DatasheetVersion: Rev. 15741.2722; ComponentLink1URL: http://www.ti.com/; PackageVersion: 4040152/C; PartNumber: TM4C123GH6PMIR; Mounting Technology: Surface Mount; Packing: Tape and Reel; PackageDescription: 64-Pin Plastic Quad Flatpack, Body 10 x 10 mm, Pitch 0.5 mm; ComponentLink3Description: Package Specification; PackageReference: PM0064A; RoHS: TRUE; ComponentLink1Description: Manufacturer URL; ComponentLink3URL: http://www.ti.com/litv/pdf/mtqf008a; Supplier 1: Digi-Key; Manufacturer Part Number: TM4C123GH6PMIR; Stock 1: 2640; Pricing 1: 1 = 11.85000, 10 = 10.70700, 25 = 10.20880, 100 = 8.86440, 250 = 8.46600, 500 = 7.71900 (USD); Case/Package: LQFP; Number of Pins: 64; Min Operating Temperature: -40°C; Max Operating Temperature: 85°C; Packaging: Tape and Reel; Number of I/Os: 43; Number of Timers/Counters: 12; Number of ADC Channels: 12; Max Frequency: 80MHz; Memory Type: FLASH; Number of UART Channels: 4; Number of A/D Converters: 12; Number of GPIO: 43; Package Quantity: 1000; Number of Bits: 12; Radiation Hardening: No; Lead Free: Lead Free; RoHS Compliant: Yes; ComponentLink4URL: https://datasheet.ciiva.com/18628/tm4c123gh6pm-18628995.pdf?src-supplier=Digi-Key; ComponentLink4Description: https://datasheet.ciiva.com/18628/tm4c123gh6pm-18628995.pdf?src-supplier=Digi-Key; ComponentLink5URL: https://datasheet.ciiva.com/29986/tm4c123gh6pm-29986949.pdf?src-supplier=Avnet; ComponentLink5Description: https://datasheet.ciiva.com/29986/tm4c123gh6pm-29986949.pdf?src-supplier=Avnet; Supplier Part Number 1: 296-46360-1-ND
Y5 = NX5032GA-16.000000MHZ: CRYSTAL 16.0000MHZ 8PF SMD; Manufacturer_Name: NDK; Manufacturer_Part_Number: NX5032GA-16.000000MHZ-LN-CD-1; Frequency: 16MHz; Frequency Tolerance: 50ppm; ESR (Equivalent Series Resistance): 120R; Datasheet Link: https://media.digikey.com/pdf/Data%20Sheets/NDK%20PDFs/NX5032GA.pdf; Height: 1.5mm; Supplier 1: Digi-Key; Supplier Part Number 1: 644-1037-1-ND; Manufacturer: NDK; Manufacturer Part Number: NX5032GA-16.000000MHZ-LN-CD-1; Stock 1: 25488; Pricing 1: 1 = 0.60000, 10 = 0.50000, 50 = 0.45000, 100 = 0.40000, 500 = 0.38000 (USD); RoHS: Yes; Mount: Surface Mount; Case/Package: SMD/SMT; Number of Pins: 2; Min Operating Temperature: -10°C; Max Operating Temperature: 70°C; Package Quantity: 1000; Load Capacitance: 8pF; Packaging: Tape and Reel; Frequency Stability: 50ppm; Series: NX5032GA; Length: 0.197inch; Width: 0.126inch; ComponentLink1URL: https://datasheet.ciiva.com/862/nx5032ga-862731.pdf?src-supplier=Digi-Key; ComponentLink1Description: https://datasheet.ciiva.com/862/nx5032ga-862731.pdf?src-supplier=Digi-Key; ComponentLink2URL: https://datasheet.ciiva.com/862/nx5032ga-862732.pdf?src-supplier=Digi-Key; ComponentLink2Description: https://datasheet.ciiva.com/862/nx5032ga-862732.pdf?src-supplier=Digi-Key; ComponentLink3URL: https://datasheet.ciiva.com/862/nx5032ga-862733.pdf?src-supplier=Digi-Key; ComponentLink3Description: https://datasheet.ciiva.com/862/nx5032ga-862733.pdf?src-supplier=Digi-Key

## Nets that join several sheets
+3.3V: [3] Microcontroller, USB, Expansion, Buttons and LED (J1.1), [4] Power Management (H22.1 H24/25.2 R27.2 U8.1), [5] In Circuit Debug Interface (16 pins)
+ICDI_VBUS: [4] Power Management (H19.1 SW4.3 SW4.6), [5] In Circuit Debug Interface (J11.1 R24.1)
+MCU_PWR: [4] Power Management (R28.2), [5] In Circuit Debug Interface (R18.1 R23.1)
+USB_VBUS: [3] Microcontroller, USB, Expansion, Buttons and LED (J9.1 R29.1), [4] Power Management (H18.1 SW4.1 SW4.4)
+VBUS: [3] Microcontroller, USB, Expansion, Buttons and LED (D1.1 J1.2), [4] Power Management (7 pins)
GND: [3] Microcontroller, USB, Expansion, Buttons and LED (11 pins), [4] Power Management (28 pins), [5] In Circuit Debug Interface (25 pins)
DEBUG_PC0/TCK/SWCLK: [3] Microcontroller, USB, Expansion, Buttons and LED (P3.1 U1.52), [5] In Circuit Debug Interface (R18.2 U2.19 U2.30)
DEBUG_PC1/TMS/SWDIO: [3] Microcontroller, USB, Expansion, Buttons and LED (P4.1 U1.51), [5] In Circuit Debug Interface (R23.2 U2.20 U2.29)
DEBUG_PC2/TDI: [3] Microcontroller, USB, Expansion, Buttons and LED (P5.1 U1.50), [5] In Circuit Debug Interface (U2.22)
DEBUG_PC3/TDO/SWO: [3] Microcontroller, USB, Expansion, Buttons and LED (P6.1 U1.49), [5] In Circuit Debug Interface (U2.21 U2.53)
nWAKE: [3] Microcontroller, USB, Expansion, Buttons and LED (R8.2), [4] Power Management (H21.1 H24/25.1 R31.2 U1.32)
PA0/U0RX_VCP_TXD: [3] Microcontroller, USB, Expansion, Buttons and LED (P1.1 U1.17), [5] In Circuit Debug Interface (U2.18)
PA1/U0TX_VCP_RXD: [3] Microcontroller, USB, Expansion, Buttons and LED (P2.1 U1.18), [5] In Circuit Debug Interface (U2.17)
TARGETRST: [3] Microcontroller, USB, Expansion, Buttons and LED (J2.10), [4] Power Management (5 pins), [5] In Circuit Debug Interface (U2.23)